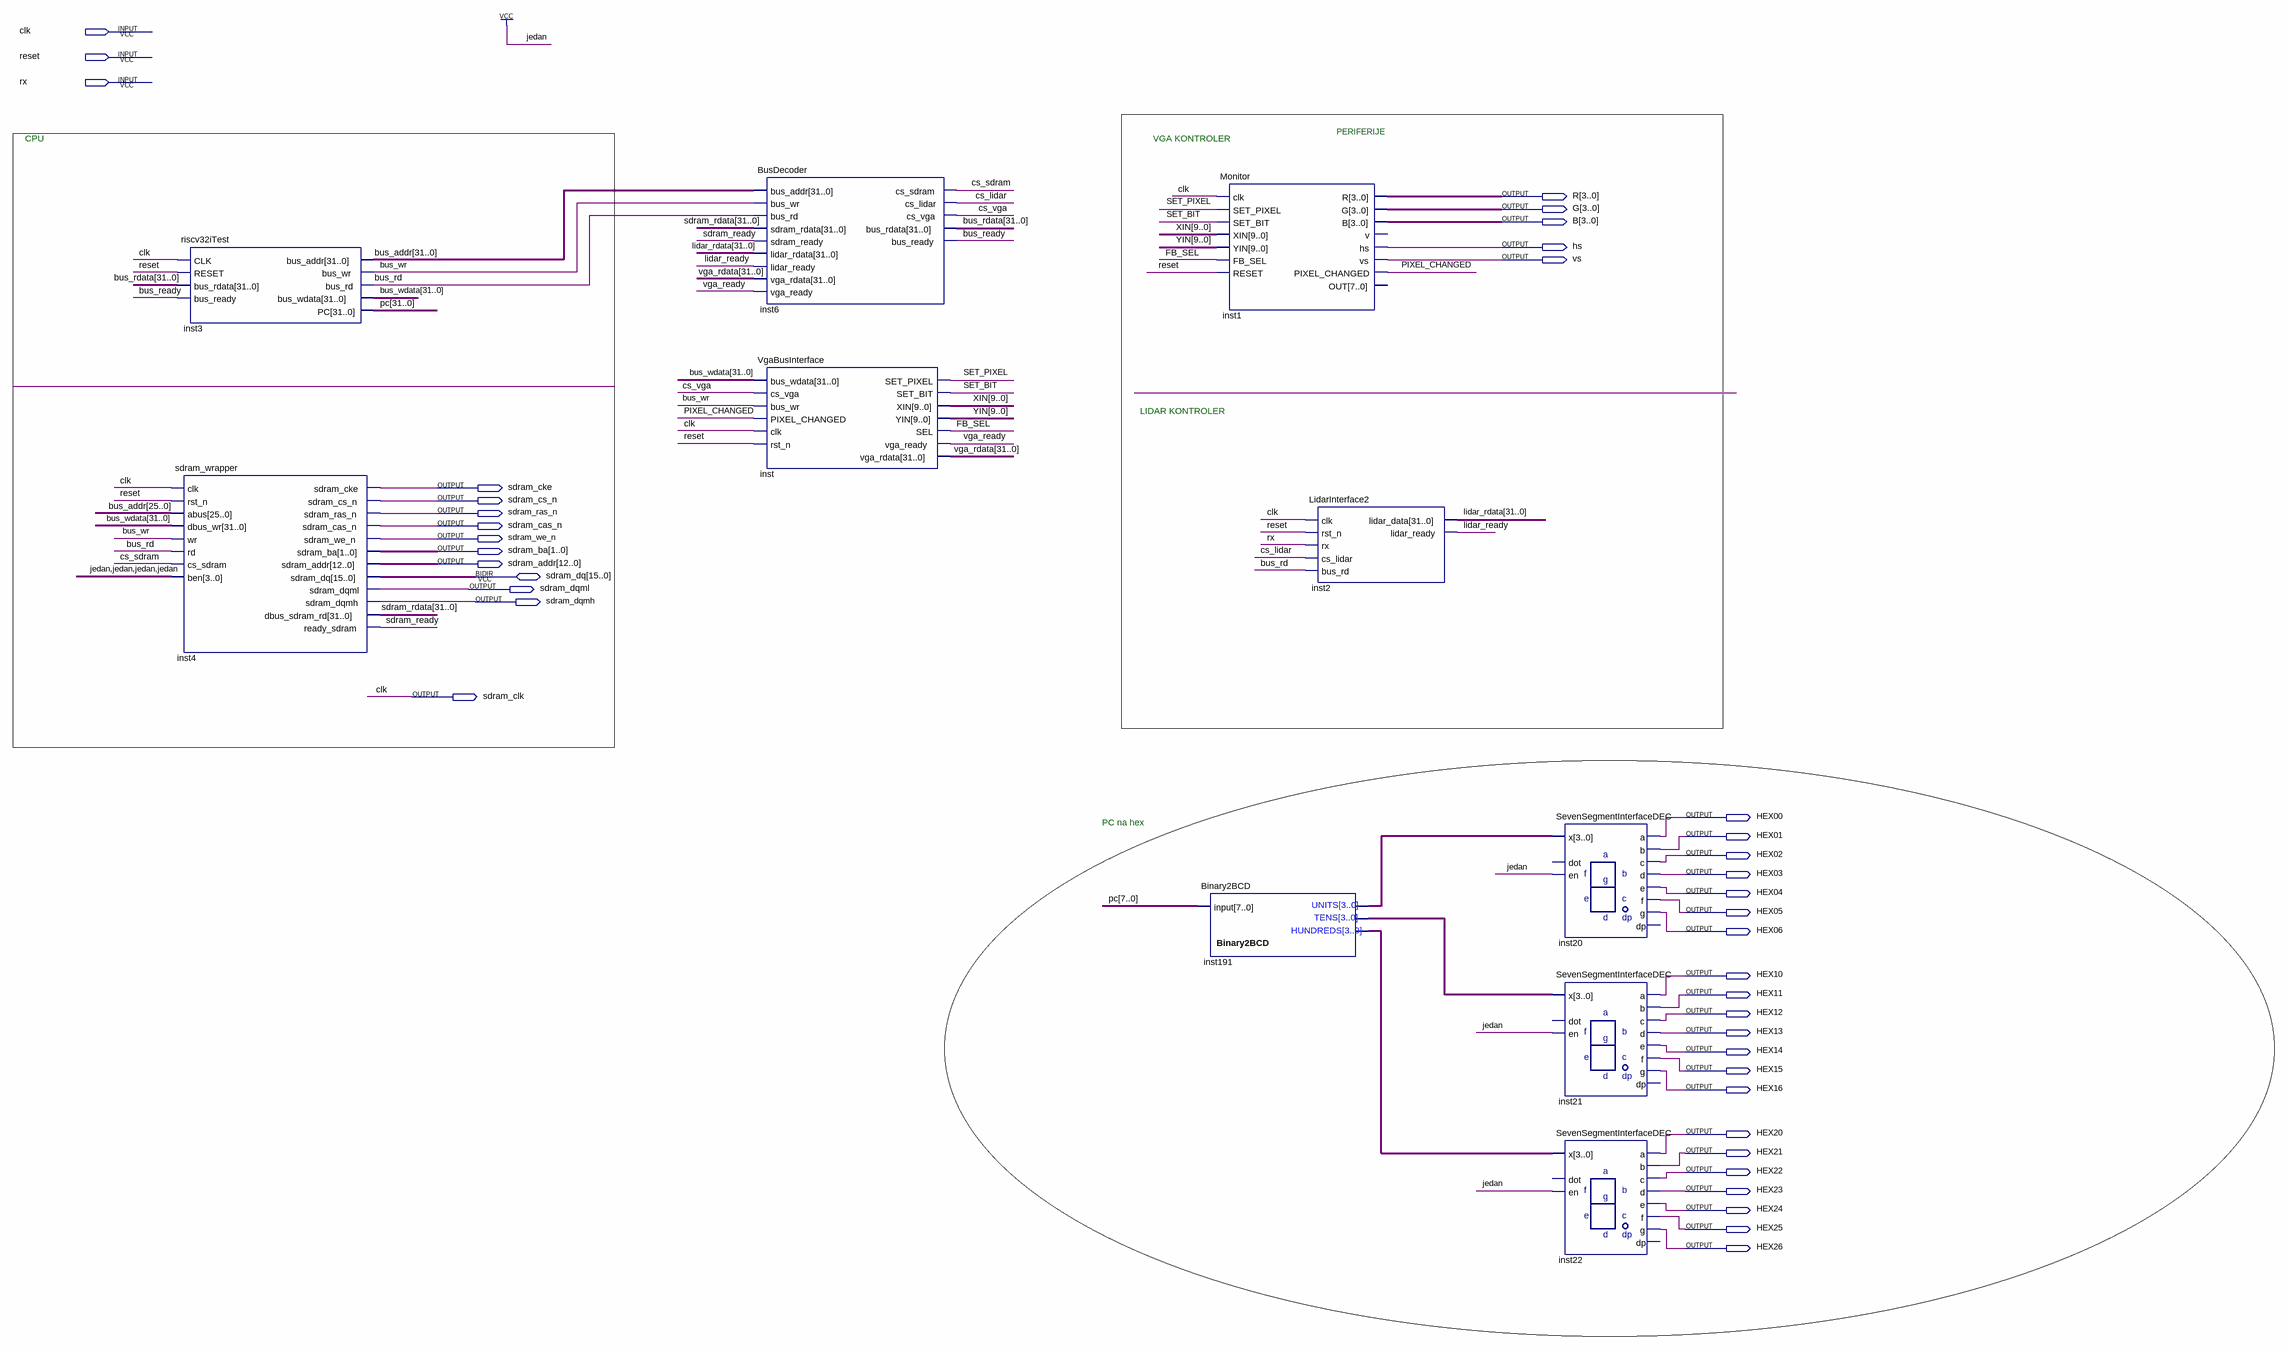
[diagram p0: schematic sheet]
// Quartus schematic MainScheme.bdf as structural Verilog: 10 symbols, 40 pins
module MainScheme (
  input  clk,
  input  reset,
  input  rx,
  inout  [15:0] sdram_dq,
  output [3:0] R,
  output [3:0] G,
  output [3:0] B,
  output hs,
  output vs,
  output sdram_cke,
  output sdram_cs_n,
  output sdram_ras_n,
  output sdram_cas_n,
  output sdram_we_n,
  output [1:0] sdram_ba,
  output [12:0] sdram_addr,
  output sdram_dqml,
  output sdram_dqmh,
  output sdram_clk,
  output HEX00,
  output HEX01,
  output HEX02,
  output HEX03,
  output HEX04,
  output HEX05,
  output HEX06,
  output HEX10,
  output HEX11,
  output HEX12,
  output HEX13,
  output HEX14,
  output HEX15,
  output HEX16,
  output HEX20,
  output HEX21,
  output HEX22,
  output HEX23,
  output HEX24,
  output HEX25,
  output HEX26
);

  wire bus_rd, bus_ready, bus_wr, cs_lidar, cs_sdram, cs_vga, FB_SEL, lidar_ready, PIXEL_CHANGED,
       sdram_ready, SET_BIT, SET_PIXEL, vga_ready;
  wire [3:0] inst191_bcd_hundreds, inst191_bcd_tens, inst191_bcd_units;
  wire [9:0] XIN, YIN;
  wire [31:0] bus_addr, bus_rdata, bus_wdata, lidar_rdata, pc, sdram_rdata, vga_rdata;

  riscv32iTest inst3 (
    .CLK(clk), .RESET(reset), .bus_rdata(bus_rdata), .bus_ready(bus_ready), .bus_addr(bus_addr),
    .bus_wr(bus_wr), .bus_rd(bus_rd), .bus_wdata(bus_wdata), .PC(pc));
  sdram_wrapper inst4 (
    .clk(clk), .rst_n(reset), .abus(bus_addr[25:0]), .dbus_wr(bus_wdata), .wr(bus_wr), .rd(bus_rd),
    .cs_sdram(cs_sdram), .ben(4'b1111), .sdram_cke(sdram_cke), .sdram_cs_n(sdram_cs_n),
    .sdram_ras_n(sdram_ras_n), .sdram_cas_n(sdram_cas_n), .sdram_we_n(sdram_we_n), .sdram_ba(sdram_ba),
    .sdram_addr(sdram_addr), .sdram_dqml(sdram_dqml), .sdram_dqmh(sdram_dqmh), .dbus_sdram_rd(sdram_rdata),
    .ready_sdram(sdram_ready), .sdram_dq(sdram_dq));
  BusDecoder inst6 (
    .bus_addr(bus_addr), .bus_wr(bus_wr), .bus_rd(bus_rd), .sdram_rdata(sdram_rdata),
    .sdram_ready(sdram_ready), .lidar_rdata(lidar_rdata), .lidar_ready(lidar_ready), .vga_rdata(vga_rdata),
    .vga_ready(vga_ready), .cs_sdram(cs_sdram), .cs_lidar(cs_lidar), .cs_vga(cs_vga), .bus_rdata(bus_rdata),
    .bus_ready(bus_ready));
  VgaBusInterface inst (
    .bus_wdata(bus_wdata), .cs_vga(cs_vga), .bus_wr(bus_wr), .PIXEL_CHANGED(PIXEL_CHANGED), .clk(clk),
    .rst_n(reset), .SET_PIXEL(SET_PIXEL), .SET_BIT(SET_BIT), .XIN(XIN), .YIN(YIN), .SEL(FB_SEL),
    .vga_ready(vga_ready), .vga_rdata(vga_rdata));
  Monitor inst1 (
    .clk(clk), .SET_PIXEL(SET_PIXEL), .SET_BIT(SET_BIT), .XIN(XIN), .YIN(YIN), .FB_SEL(FB_SEL),
    .RESET(reset), .R(R), .G(G), .B(B), .hs(hs), .vs(vs), .PIXEL_CHANGED(PIXEL_CHANGED));  // open: v, OUT
  Binary2BCD inst191 (
    .\input (pc[7:0]), .bcd_hundreds(inst191_bcd_hundreds), .bcd_tens(inst191_bcd_tens),
    .bcd_units(inst191_bcd_units));
  LidarInterface2 inst2 (
    .clk(clk), .rst_n(reset), .rx(rx), .cs_lidar(cs_lidar), .bus_rd(bus_rd), .lidar_data(lidar_rdata),
    .lidar_ready(lidar_ready));
  SevenSegmentInterfaceDEC inst20 (
    .en(1'b1), .x(inst191_bcd_units), .a(HEX00), .b(HEX01), .c(HEX02), .d(HEX03), .e(HEX04), .f(HEX05),
    .g(HEX06));  // open: dot, dp
  SevenSegmentInterfaceDEC inst21 (
    .en(1'b1), .x(inst191_bcd_tens), .a(HEX10), .b(HEX11), .c(HEX12), .d(HEX13), .e(HEX14), .f(HEX15),
    .g(HEX16));  // open: dot, dp
  SevenSegmentInterfaceDEC inst22 (
    .en(1'b1), .x(inst191_bcd_hundreds), .a(HEX20), .b(HEX21), .c(HEX22), .d(HEX23), .e(HEX24), .f(HEX25),
    .g(HEX26));  // open: dot, dp

  assign sdram_clk = clk;

  // Notes on the sheet:
  //   PERIFERIJE
  //   CPU
  //   VGA KONTROLER
  //   LIDAR KONTROLER
  //   PC na hex
endmodule
